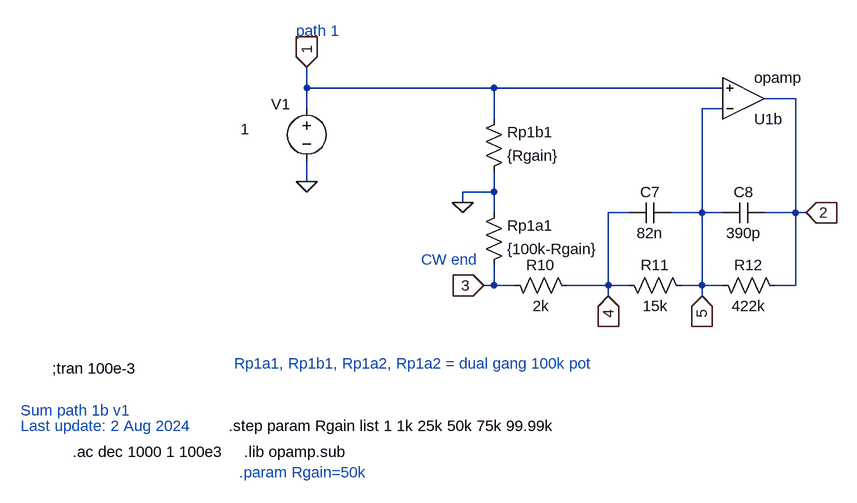
[diagram p0: schematic Klon-Centaur_sum_path1b_v1.asc]
Klon-Centaur_sum_path1b_v1.asc, the LTspice schematic file:
Version 4
SHEET 1 4496 5064
WIRE 80 2560 80 2528
WIRE 368 2560 80 2560
WIRE 720 2560 368 2560
WIRE 832 2576 784 2576
WIRE 80 2592 80 2560
WIRE 720 2592 688 2592
WIRE 368 2608 368 2560
WIRE 80 2704 80 2672
WIRE 368 2720 368 2688
WIRE 368 2720 320 2720
WIRE 320 2736 320 2720
WIRE 368 2752 368 2720
WIRE 576 2752 544 2752
WIRE 688 2752 688 2592
WIRE 688 2752 640 2752
WIRE 720 2752 688 2752
WIRE 832 2752 832 2576
WIRE 832 2752 784 2752
WIRE 848 2752 832 2752
WIRE 368 2864 368 2832
WIRE 368 2864 352 2864
WIRE 400 2864 368 2864
WIRE 544 2864 544 2752
WIRE 544 2864 480 2864
WIRE 576 2864 544 2864
WIRE 688 2864 688 2752
WIRE 688 2864 656 2864
WIRE 720 2864 688 2864
WIRE 832 2864 832 2752
WIRE 832 2864 800 2864
WIRE 544 2880 544 2864
WIRE 688 2880 688 2864
FLAG 80 2528 1
IOPIN 80 2528 In
FLAG 80 2704 0
FLAG 352 2864 3
IOPIN 352 2864 In
FLAG 544 2880 4
IOPIN 544 2880 In
FLAG 688 2880 5
IOPIN 688 2880 In
FLAG 848 2752 2
IOPIN 848 2752 In
FLAG 320 2736 0
SYMBOL voltage 80 2576 R0
WINDOW 0 -55 9 Left 2
WINDOW 39 0 0 Left 0
WINDOW 3 -102 47 Left 2
SYMATTR InstName V1
SYMATTR Value 1
SYMATTR Value2 AC 1 0
SYMBOL res 352 2704 M180
WINDOW 0 36 76 Left 2
WINDOW 3 36 40 Left 2
SYMATTR InstName Rp1b1
SYMATTR Value {Rgain}
SYMBOL res 352 2848 M180
WINDOW 3 36 40 Left 2
WINDOW 0 36 76 Left 2
SYMATTR Value {100k-Rgain}
SYMATTR InstName Rp1a1
SYMBOL res 496 2880 M270
WINDOW 0 32 56 VTop 2
WINDOW 3 0 56 VBottom 2
SYMATTR InstName R10
SYMATTR Value 2k
SYMBOL res 672 2880 M270
WINDOW 0 32 56 VTop 2
WINDOW 3 0 56 VBottom 2
SYMATTR InstName R11
SYMATTR Value 15k
SYMBOL cap 640 2768 M270
WINDOW 0 32 32 VTop 2
WINDOW 3 0 32 VBottom 2
SYMATTR InstName C7
SYMATTR Value 82n
SYMBOL cap 784 2768 M270
WINDOW 0 32 32 VTop 2
WINDOW 3 0 32 VBottom 2
SYMATTR InstName C8
SYMATTR Value 390p
SYMBOL res 816 2880 M270
WINDOW 0 32 56 VTop 2
WINDOW 3 0 56 VBottom 2
SYMATTR InstName R12
SYMATTR Value 422k
SYMBOL OpAmps\\opamp 752 2640 M180
SYMATTR InstName U1b
TEXT -16 3120 Left 2 !.lib opamp.sub
TEXT -280 3120 Left 2 !.ac dec 1000 1 100e3
TEXT 256 2824 Left 2 ;CW end
TEXT -40 3080 Left 2 !.step param Rgain list 1 1k 25k 50k 75k 99.99k
TEXT -32 2984 Left 2 ;Rp1a1, Rp1b1, Rp1a2, Rp1a2 = dual gang 100k pot
TEXT -312 2992 Left 2 !;tran 100e-3
TEXT -24 3152 Left 2 ;.param Rgain=50k
TEXT -360 3056 Left 2 ;Sum path 1b v1
TEXT 64 2472 Left 2 ;path 1
TEXT -360 3080 Left 2 ;Last update: 2 Aug 2024

The netlist it stands for:
* Klon-Centaur_sum_path1b_v1.asc
V1 1 0 1 AC 1 0
Rp1b1 0 1 {Rgain}
Rp1a1 3 0 {100k-Rgain}
R10 4 3 2k
R11 5 4 15k
C7 5 4 82n
C8 2 5 390p
R12 2 5 422k
XU1b 5 1 2 opamp Aol=100K GBW=10Meg  ; pins invin noninvin out
.lib opamp.sub
.ac dec 1000 1 100e3
* CW end
.step param Rgain list 1 1k 25k 50k 75k 99.99k
* Rp1a1, Rp1b1, Rp1a2, Rp1a2 = dual gang 100k pot
;tran 100e-3
* .param Rgain=50k
* Sum path 1b v1
* path 1
* Last update: 2 Aug 2024
.backanno
.end